# Altium project EL-23 Connector.PrjPCB
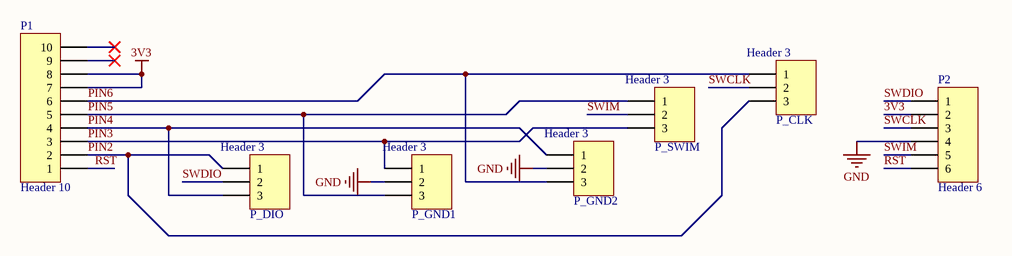
[diagram p0: EL-23 Main.SchDoc]
1 sheet, 7 parts. Net scope: global (net labels, ports and power ports of the same name join across sheets).
Board file: EL-23 PCB.PcbDoc

## Sheet EL-23 Main.SchDoc
size A4; Author: Bazyli Polednia; CompanyName: AGH Racing; Revision: Rev; SheetNumber: 0; SheetTotal: 0; CarNumber: 5; ProjectName: Project Name

### Parts
P1  Header 10  [SHDRV10W102P254_2X5_2032X895X915P]
P2  Header 6  [HEADER_2x3_1_17_WOMAN_THT]
P_CLK  Header 3  [HEADER 1x3 1.27mm]
P_DIO  Header 3  [HEADER 1x3 1.27mm]
P_GND1  Header 3  [HEADER 1x3 1.27mm]
P_GND2  Header 3  [HEADER 1x3 1.27mm]
P_SWIM  Header 3  [HEADER 1x3 1.27mm]

### Nets
3V3: P1.7 P1.8 P2.2
GND: P2.4 P_GND1.2 P_GND2.2
PIN2: P1.2 P_CLK.3 P_DIO.1
PIN3: P1.3 P_GND1.1 P_SWIM.3
PIN4: P1.4 P_DIO.3 P_GND2.1
PIN5: P1.5 P_GND1.3 P_SWIM.1
PIN6: P1.6 P_CLK.1 P_GND2.3
RST: P1.1 P2.6
SWCLK: P2.3 P_CLK.2
SWDIO: P2.1 P_DIO.2
SWIM: P2.5 P_SWIM.2

Not connected (* = marked no-connect by the designer): P1 9* 10*

### Notes on the sheet
- Confidential / Not for distribution !
- Project name:
- Document name:
- Sheet:
- Car No.
- of
- Designer Name:
- Date/Time:
- Revision:

### Library data of the parts
P1 = Header 10: Header, 10-Pin
P2 = Header 6: Header, 6-Pin
P_CLK P_DIO P_GND1 P_GND2 P_SWIM = Header 3: Header, 3-Pin